# Altium schematic sheet [02] - REVISION HISTORY.SchDoc: Test title
size A4; Project name:: Test name; Client: DSG; Date: YYYY-MM-DD; Engineer: X; SheetNumber: 2; Size: A4
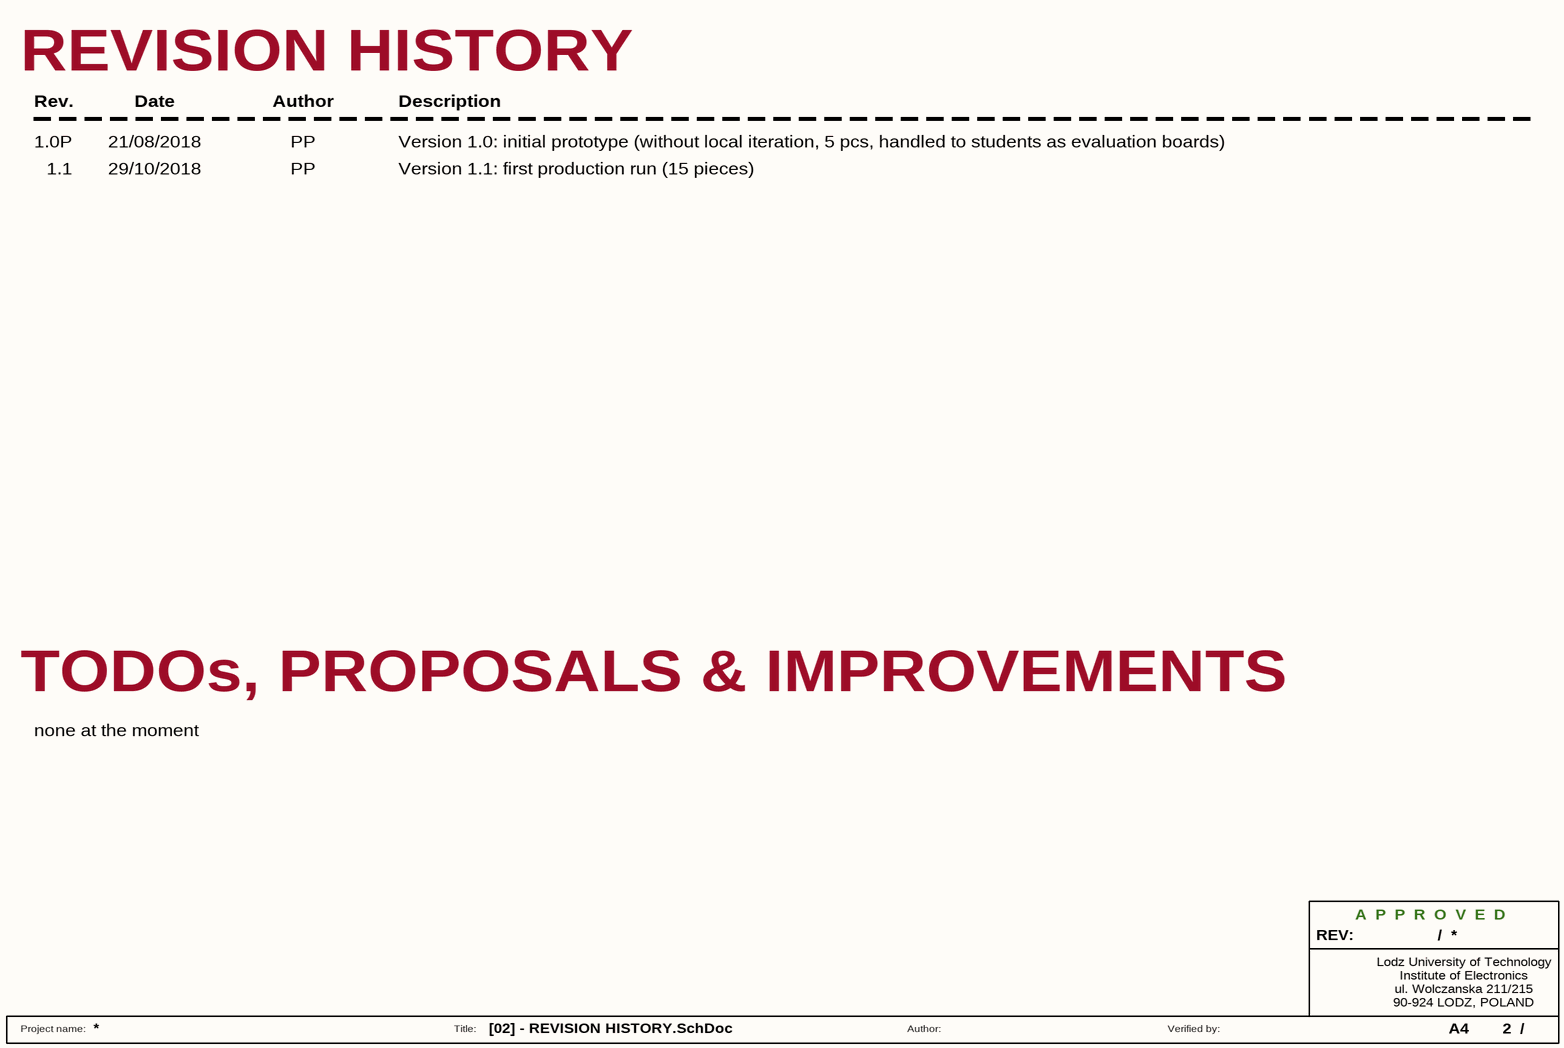
[diagram p0: [02] - REVISION HISTORY.SchDoc]

## Notes on the sheet
- REVISION HISTORY
- Rev.
- Date
- Author
- Description
- 1.0P
- 1.1
- 21/08/2018
- 29/10/2018
- PP
- Version 1.0: initial prototype (without local iteration, 5 pcs, handled to students as evaluation boards)
- Version 1.1: first production run (15 pieces)
- TODOs, PROPOSALS & IMPROVEMENTS
- none at the moment
- REV:
- A  P  P  R  O  V  E  D
- /
- Lodz University of Technology
- ul. Wolczanska 211/215
- 90-924 LODZ, POLAND
- Institute of Electronics
- Project name:
- Title:
- Author:
- Verified by: